# EAGLE design line-drive (EAGLE 5.11)
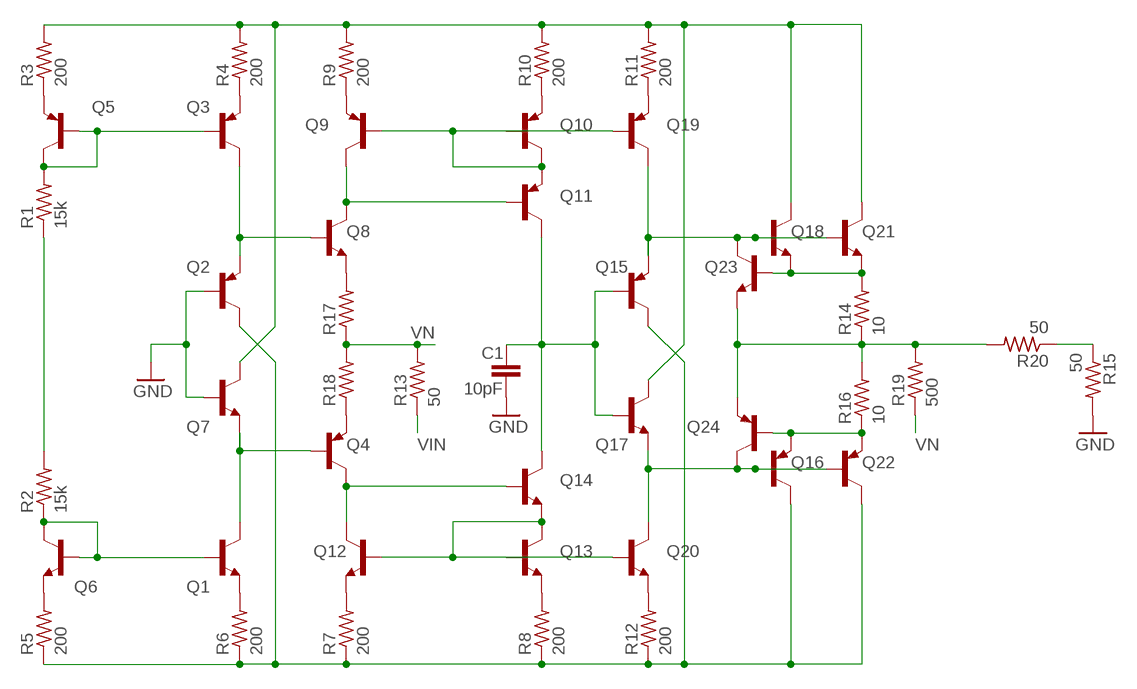
[diagram p0: schematic, sheet 1]

## Parts
C1  10pF  C-EU025-025X050  [C025-025X050]
Q1  2N3904  [TO92]
Q2  2N3906  [TO92]
Q3  2N3906  [TO92]
Q4  2N3906  [TO92]
Q5  2N3906  [TO92]
Q6  2N3904  [TO92]
Q7  2N3904  [TO92]
Q8  2N3904  [TO92]
Q9  2N3906  [TO92]
Q10  2N3906  [TO92]
Q11  2N3906  [TO92]
Q12  2N3904  [TO92]
Q13  2N3904  [TO92]
Q14  2N3904  [TO92]
Q15  2N3906  [TO92]
Q16  2N3906  [TO92]
Q17  2N3904  [TO92]
Q18  2N3904  [TO92]
Q19  2N3906  [TO92]
Q20  2N3904  [TO92]
Q21  2N3904  [TO92]
Q22  2N3906  [TO92]
Q23  2N3904  [TO92]
Q24  2N3906  [TO92]
R1  15k  R-US_0309/V  [0309V]
R2  15k  R-US_0309/V  [0309V]
R3  200  R-US_0309/V  [0309V]
R4  200  R-US_0309/V  [0309V]
R5  200  R-US_0309/V  [0309V]
R6  200  R-US_0309/V  [0309V]
R7  200  R-US_0309/V  [0309V]
R8  200  R-US_0309/V  [0309V]
R9  200  R-US_0309/V  [0309V]
R10  200  R-US_0309/V  [0309V]
R11  200  R-US_0309/V  [0309V]
R12  200  R-US_0309/V  [0309V]
R13  50  R-US_0309/V  [0309V]
R14  10  R-US_0309/V  [0309V]
R15  50  R-US_0309/V  [0309V]
R16  10  R-US_0309/V  [0309V]
R17  R-US_0309/V  [0309V]
R18  R-US_0309/V  [0309V]
R19  500  R-US_0309/V  [0309V]
R20  50  R-US_0309/V  [0309V]

## Nets
GND: C1.2 Q2.2(B) Q7.2(B) R15.2
N$1: Q3.2(B) Q5.1(C) Q5.2(B) R1.2
N$2: Q1.2(B) Q6.1(C) Q6.2(B) R2.1
N$3: R1.1 R2.2
N$4: Q5.3(E) R3.1
N$5: Q18.3(E) Q21.3(E) Q23.2(B) R14.2
N$6: R15.1 R20.1
N$7: Q3.3(E) R4.1
N$8: Q6.3(E) R5.2
N$9: Q2.3(E) Q3.1(C) Q8.2(B)
N$10: Q1.1(C) Q4.2(B) Q7.3(E)
N$13: Q1.3(E) R6.2
N$14: Q8.1(C) Q9.1(C) Q11.2(B)
N$15: Q9.2(B) Q10.1(C) Q10.2(B) Q11.3(E) Q19.2(B)
N$16: Q4.1(C) Q12.1(C) Q14.2(B)
N$17: Q12.2(B) Q13.1(C) Q13.2(B) Q14.3(E) Q20.2(B)
N$18: Q12.3(E) R7.2
N$19: Q16.3(E) Q22.3(E) Q24.2(B) R16.1
N$20: Q13.3(E) R8.2
N$21: Q9.3(E) R9.1
N$22: Q10.3(E) R10.1
N$23: Q7.1(C) Q17.1(C) Q18.1(C) Q21.1(C) R3.2 R4.2 R9.2 R10.2 R11.2
N$25: Q15.3(E) Q18.2(B) Q19.1(C) Q21.2(B) Q23.1(C)
N$26: Q16.2(B) Q17.3(E) Q20.1(C) Q22.2(B) Q24.1(C)
N$27: C1.1 Q11.1(C) Q14.1(C) Q15.2(B) Q17.2(B)
N$28: Q8.3(E) R17.2
N$29: Q23.3(E) Q24.3(E) R14.1 R16.2 R19.2 R20.2
N$30: Q2.1(C) Q15.1(C) Q16.1(C) Q22.1(C) R5.1 R6.1 R7.1 R8.1 R12.1
N$31: Q19.3(E) R11.1
N$32: Q20.3(E) R12.2
N$33: Q4.3(E) R18.1
VIN: R13.1
VN: R13.2 R17.1 R18.2 R19.1

## Library data of the parts
C1 = makani_rcl:C-EU: CAPACITOR, European symbol
Q1 Q6-Q8 Q12-Q14 Q17 Q18 Q20 Q21 Q23 = transistor-npn:2N3904: NPN Transistor
Q2-Q5 Q9-Q11 Q15 Q16 Q19 Q22 Q24 = transistor-pnp:2N3906: PNP Transistor
R1-R20 = resistor:R-US_: RESISTOR, American symbol

## Board
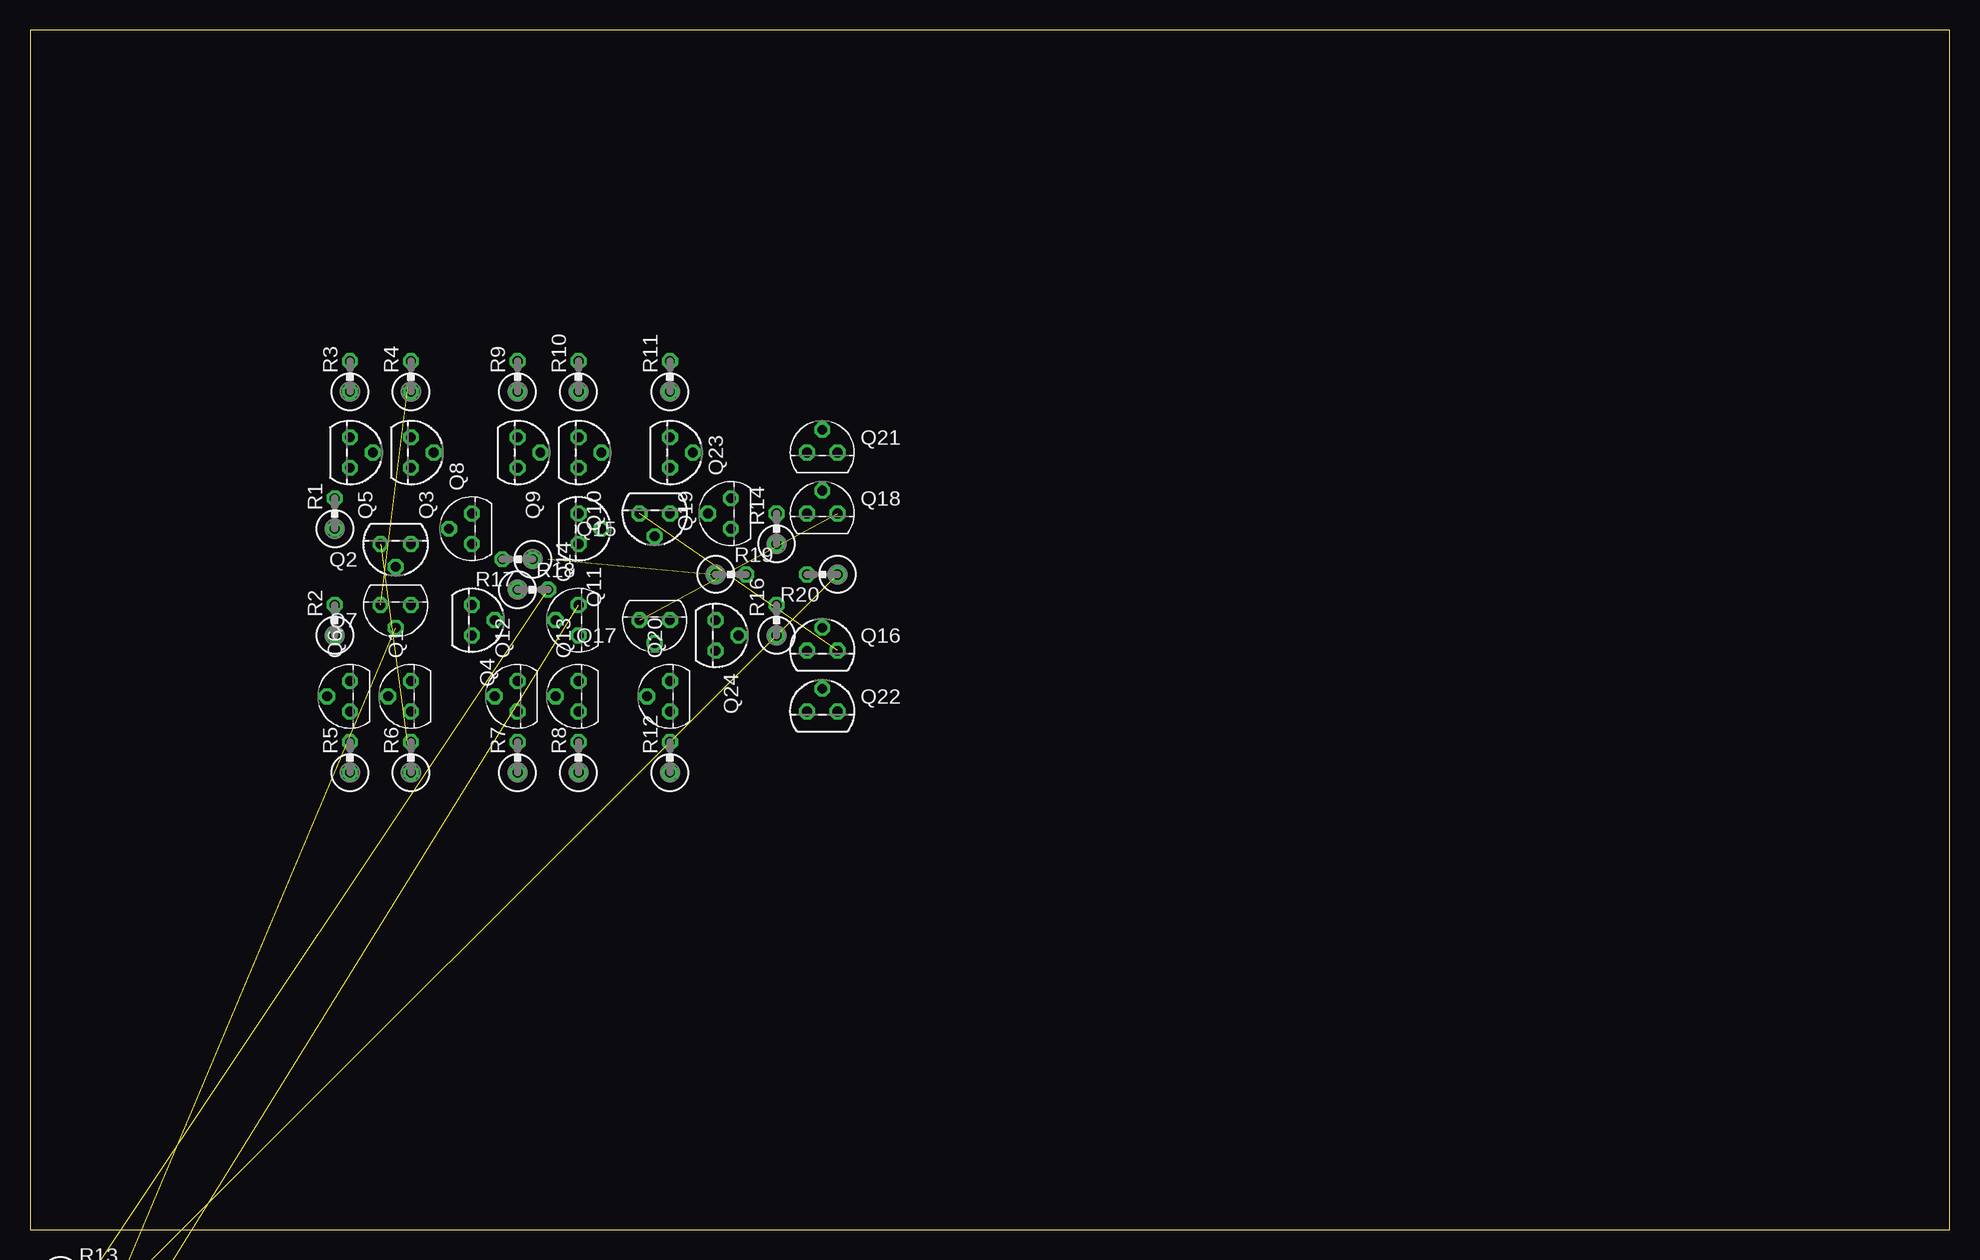
[diagram p1: board, top side]
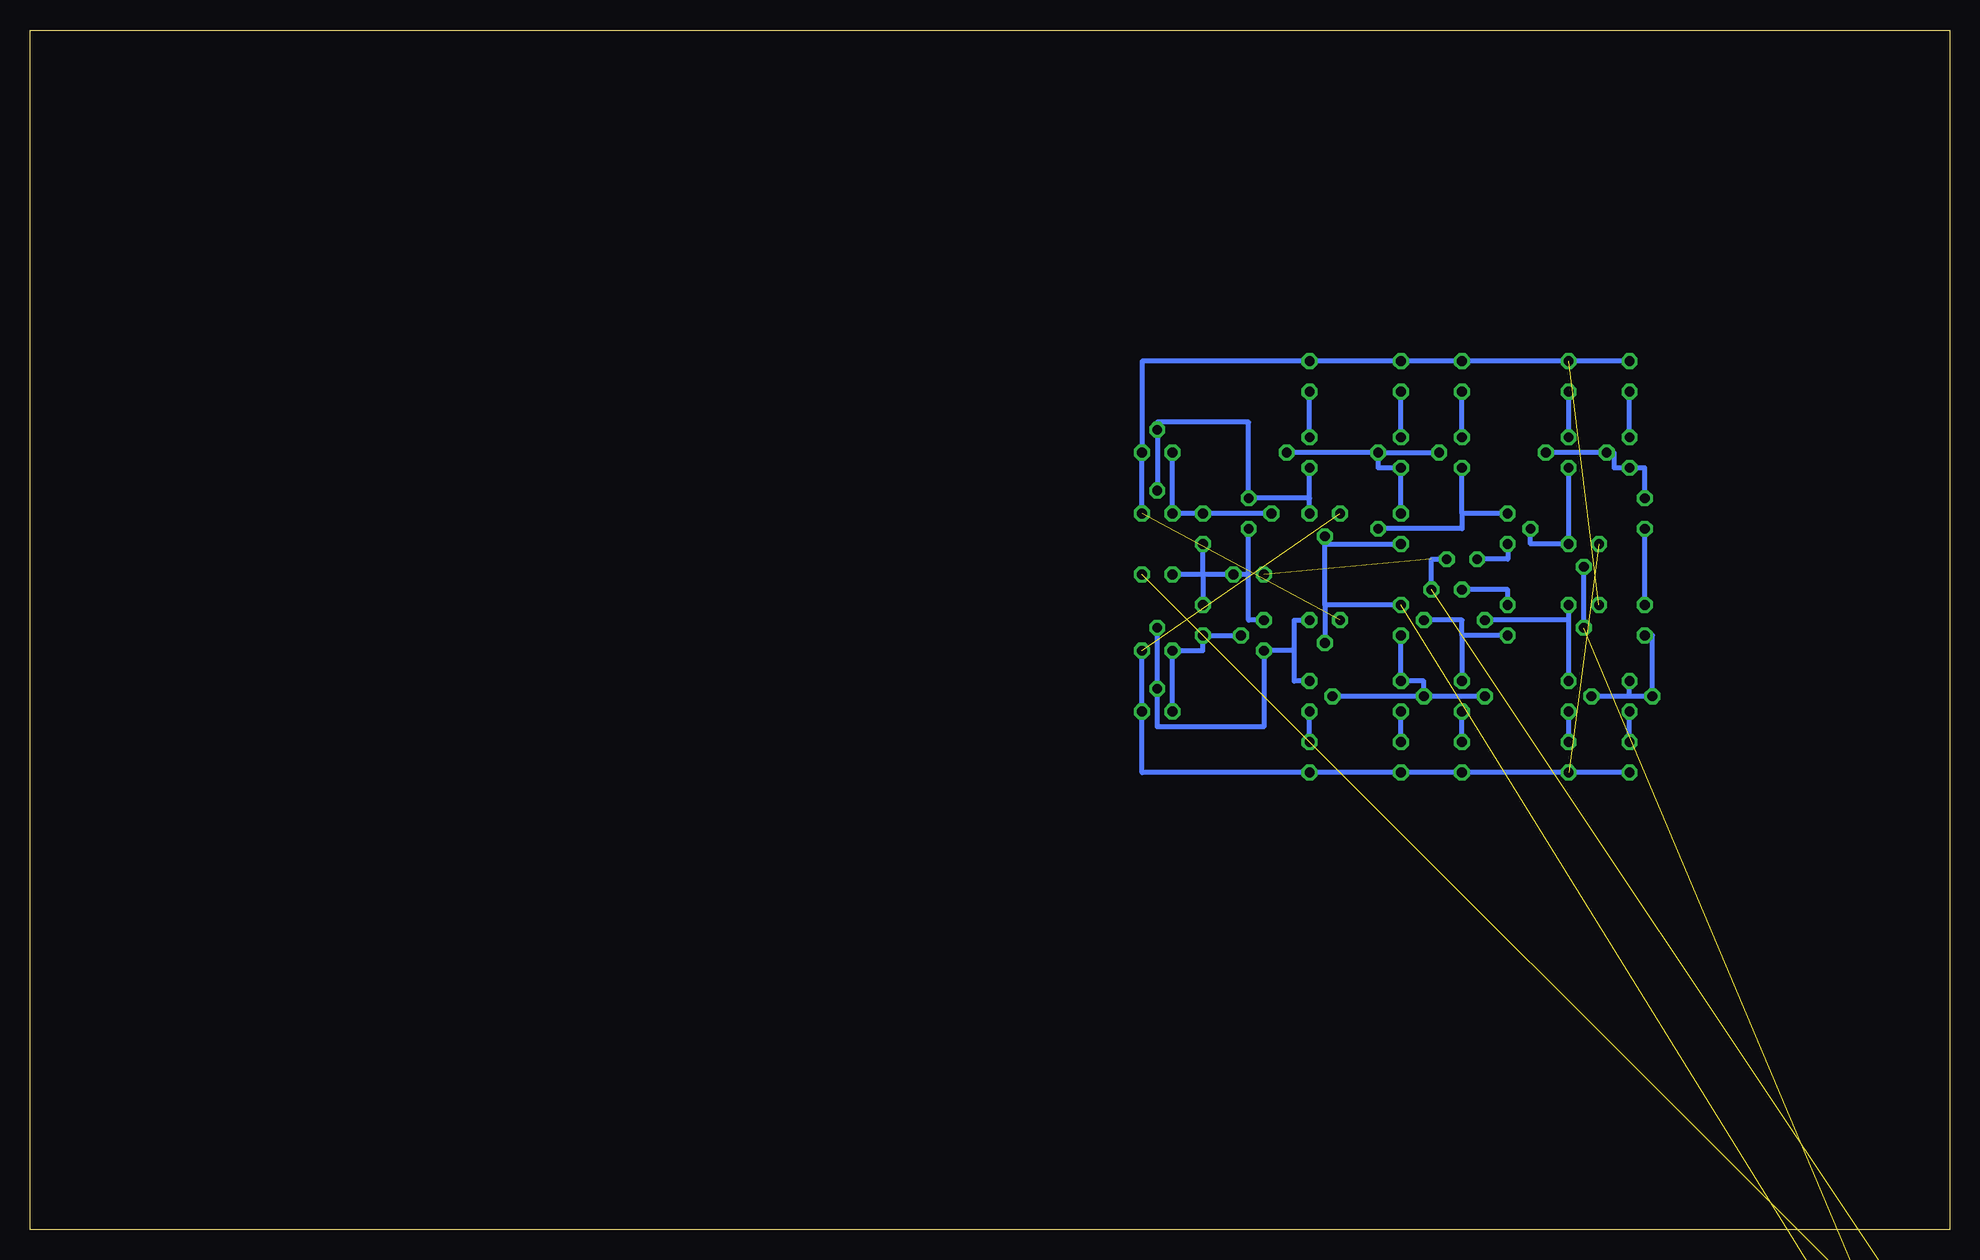
[diagram p2: board, bottom side, seen from below]

Size 160 x 100 mm. Coordinates in mm from the lower left corner, seen from the top.
Outline: 0,0 160,0 160,100 0,100 0,0
Copper layers (1*16): Top 0.035mm / dielectric 1.5mm / Bottom 0.035mm
Design rules "default": minimum track width 10mil, minimum drill 24mil, track to track 8mil, track to pad 8mil, pad to pad 8mil, via to via 8mil, smd to smd 8mil, copper to edge 40mil, drill to drill 8mil, minimum pad ring 10mil, minimum via ring 8mil, stop-mask expansion 4mil, vias tented up to drill 0mil, thermal gap 10mil

### Footprints (pad centres in the part's own frame; a part is rotated, then mirrored left to right if it is on the bottom)
C025-025X050 = drill 0.813 octagon: 1 -1.27,0; 2 1.27,0
TO92 = drill 0.813 octagon: 1 1.27,0; 2 0,1.905; 3 -1.27,0
0309V = drill 0.813 octagon: 1 -1.27,0; 2 1.27,0

### Placement (x,y rotation side)
C1  3.81,-17.78 0 top  (outside the outline)
Q1  31.75,44.45 90 top
Q2  30.48,57.15 180 top
Q3  31.75,64.77 270 top
Q4  36.83,50.8 270 top
Q5  26.67,64.77 270 top
Q6  26.67,44.45 90 top
Q7  30.48,52.07 180 top
Q8  36.83,58.42 90 top
Q9  40.64,64.77 270 top
Q10  45.72,64.77 270 top
Q11  45.72,58.42 270 top
Q12  40.64,44.45 90 top
Q13  45.72,44.45 90 top
Q14  45.72,50.8 90 top
Q15  52.07,59.69 180 top
Q16  66.04,48.26 0 top
Q17  52.07,50.8 180 top
Q18  66.04,59.69 0 top
Q19  53.34,64.77 270 top
Q20  53.34,44.45 90 top
Q21  66.04,64.77 0 top
Q22  66.04,43.18 0 top
Q23  58.42,59.69 90 top
Q24  57.15,49.53 270 top
R1  25.4,59.69 90 top
R2  25.4,50.8 90 top
R3  26.67,71.12 90 top
R4  31.75,71.12 90 top
R5  26.67,39.37 90 top
R6  31.75,39.37 90 top
R7  40.64,39.37 90 top
R8  45.72,39.37 90 top
R9  40.64,71.12 90 top
R10  45.72,71.12 90 top
R11  53.34,71.12 90 top
R12  53.34,39.37 90 top
R13  3.81,-3.81 0 top  (outside the outline)
R14  62.23,58.42 90 top
R15  3.81,-10.16 0 top  (outside the outline)
R16  62.23,50.8 90 top
R17  40.64,55.88 180 top
R18  41.91,53.34 0 top
R19  58.42,54.61 0 top
R20  66.04,54.61 180 top

### Tracks (layer width: path | path; a pad name or v marks a point on that pad's centre or on a via)
GND  (2 unrouted)
  Bottom 0.406: Q7.2 Q2.2
N$1
  Bottom 0.406: Q3.2 Q5.2 27.94,64.77 27.94,63.5 Q5.1 25.4,63.5 R1.2
N$2
  Bottom 0.406: R2.1 24.77,49.53 Q6.2 26.67,44.45 | 26.67,44.45 Q1.2 | 26.67,44.45 Q6.1
N$3
  Bottom 0.406: R2.2 R1.1
N$4
  Bottom 0.406: Q5.3 R3.1
N$5
  Bottom 0.406: Q21.3 Q18.3 R14.2 Q23.2
N$6  (1 unrouted)
N$7
  Bottom 0.406: Q3.3 R4.1
N$8
  Bottom 0.406: R5.2 Q6.3
N$9
  Bottom 0.406: Q8.2 34.92,57.15 Q2.3 Q3.1
N$10
  Bottom 0.406: 31.75,50.8 Q4.2 | Q1.1 31.75,50.8 | 31.75,50.8 Q7.3
N$13
  Bottom 0.406: R6.2 Q1.3
N$14
  Bottom 0.406: 40.64,59.69 40.64,58.42 Q11.2 | 40.64,59.69 Q9.1 | Q8.1 40.64,59.69
N$15
  Bottom 0.406: Q11.3 Q10.1 47.62,63.5 Q10.2 | Q10.2 Q9.2 | Q10.2 Q19.2
N$16
  Bottom 0.406: Q14.2 40.64,50.8 40.64,49.53 | 40.64,49.53 Q12.1 | Q4.1 40.64,49.53
N$17
  Bottom 0.406: Q13.2 Q20.2 | Q13.2 43.81,45.72 Q13.1 Q14.3 | Q12.2 Q13.2
N$18
  Bottom 0.406: R7.2 Q12.3
N$19
  Bottom 0.406: Q22.3 Q16.3 62.23,48.26 R16.1 Q24.2
N$20
  Bottom 0.406: R8.2 Q13.3
N$21
  Bottom 0.406: Q9.3 R9.1
N$22
  Bottom 0.406: Q10.3 R10.1
N$23  (2 unrouted)
  Bottom 0.406: Q18.1 Q21.1 67.31,72.39 R11.2 R10.2 R9.2 R4.2 R3.2
N$25
  Bottom 0.406: Q18.2 Q21.2 66.04,67.31 58.42,67.31 Q23.1 53.34,60.96 | Q15.3 53.34,60.96 | 53.34,60.96 Q19.1
N$26
  Bottom 0.406: Q16.2 Q22.2 66.04,41.91 57.15,41.91 Q24.1 54.61,48.26 | Q17.3 54.61,50.8 54.61,48.26 | Q20.1 54.61,45.72 54.61,48.26
N$27  (1 unrouted)
  Bottom 0.406: 52.07,52.07 Q17.2 | 52.07,52.07 52.07,57.15 | 52.07,57.15 Q15.2 | 52.07,57.15 Q11.1 | Q14.1 52.07,52.07
N$28
  Bottom 0.406: Q8.3 36.83,55.88 R17.2
N$29
  Bottom 0.406: 62.23,54.61 R16.2 | 62.23,54.61 R14.1 | 62.23,54.61 R20.2 | 62.23,54.61 R19.2 58.42,54.61 | 58.42,54.61 Q23.3 | Q24.3 58.42,50.8 58.42,54.61
N$30  (2 unrouted)
  Bottom 0.406: Q16.1 Q22.1 67.31,38.1 R12.1 R8.1 R7.1 R6.1 R5.1
N$31
  Bottom 0.406: Q19.3 R11.1
N$32
  Bottom 0.406: R12.2 Q20.3
N$33
  Bottom 0.406: R18.1 36.83,53.34 Q4.3
VN  (2 unrouted)
  Bottom 0.406: R17.1 43.18,55.88 R18.2